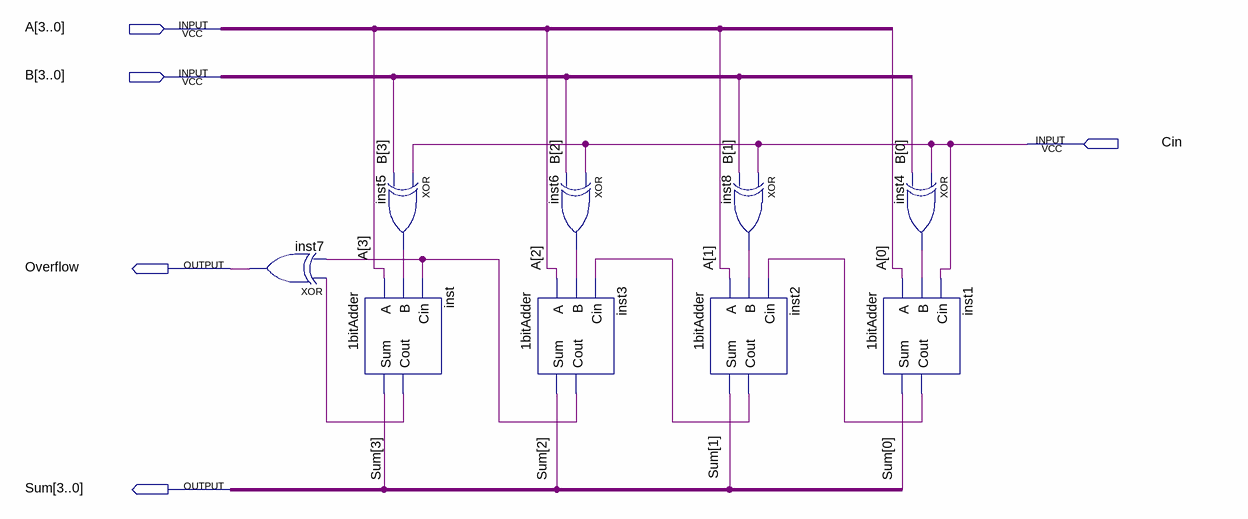
[diagram p0: schematic sheet]
// Quartus schematic 4bitAdder.bdf as structural Verilog: 9 symbols, 5 pins
module \4bitAdder  (
  input  [3:0] A,
  input  [3:0] B,
  input  Cin,
  output Overflow,
  output [3:0] Sum
);

  wire inst1_cout, inst2_cout, inst3_cout, inst4_out, inst5_out, inst6_out, inst8_out, inst_cout;

  xor inst7 (Overflow, inst_cout, inst3_cout);
  \1bitAdder  inst (.A(A[3]), .B(inst5_out), .Cin(inst3_cout), .Sum(Sum[3]), .Cout(inst_cout));
  xor inst5 (inst5_out, Cin, B[3]);
  \1bitAdder  inst3 (.A(A[2]), .B(inst6_out), .Cin(inst2_cout), .Sum(Sum[2]), .Cout(inst3_cout));
  xor inst6 (inst6_out, Cin, B[2]);
  xor inst8 (inst8_out, Cin, B[1]);
  \1bitAdder  inst2 (.A(A[1]), .B(inst8_out), .Cin(inst1_cout), .Sum(Sum[1]), .Cout(inst2_cout));
  xor inst4 (inst4_out, Cin, B[0]);
  \1bitAdder  inst1 (.A(A[0]), .B(inst4_out), .Cin(Cin), .Sum(Sum[0]), .Cout(inst1_cout));
endmodule
